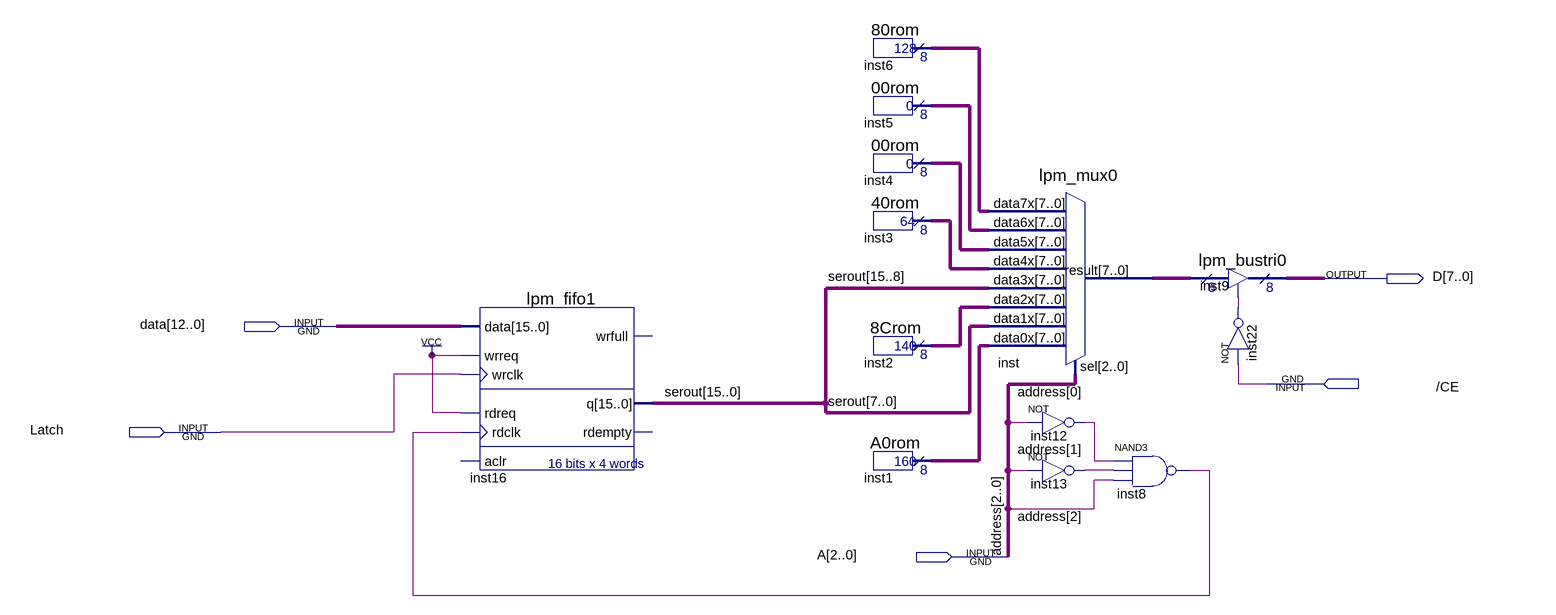
[diagram p0: schematic sheet]
// Quartus schematic TsundereFIFO.bdf as structural Verilog: 13 symbols, 5 pins
module TsundereFIFO (
  input  [12:0] data,
  input  \/CE ,
  input  Latch,
  input  [2:0] A,
  output [7:0] D
);

  wire inst8_out, inst12_out, inst13_out, inst22_out;
  wire [7:0] inst1_result, inst2_result, inst3_result, inst4_result, inst5_result, inst6_result, inst_result;
  wire [15:0] serout;

  lpm_fifo1 inst16 (
    .data(data), .wrreq(1'b1), .wrclk(Latch), .rdreq(1'b1), .rdclk(inst8_out), .q(serout));  // open: aclr, wrfull, rdempty
  \80rom  inst6 (.result(inst6_result));
  \00rom  inst5 (.result(inst5_result));
  \00rom  inst4 (.result(inst4_result));
  \40rom  inst3 (.result(inst3_result));
  \8Crom  inst2 (.result(inst2_result));
  A0rom inst1 (.result(inst1_result));
  lpm_mux0 inst (
    .data7x(inst6_result), .data6x(inst5_result), .data5x(inst4_result), .data4x(inst3_result),
    .data3x(serout[15:8]), .data2x(inst2_result), .data1x(serout[7:0]), .data0x(inst1_result), .sel(A),
    .result(inst_result));
  not inst12 (inst12_out, A[0]);
  not inst13 (inst13_out, A[1]);
  nand inst8 (inst8_out, inst12_out, inst13_out, A[2]);
  lpm_bustri0 inst9 (.enabledt(inst22_out), .data(inst_result), .tridata(D));
  not inst22 (inst22_out, \/CE );

  // Other names for the same wires on the sheet: address[2:0] = A
endmodule
